# EAGLE design switch (EAGLE 5.10)
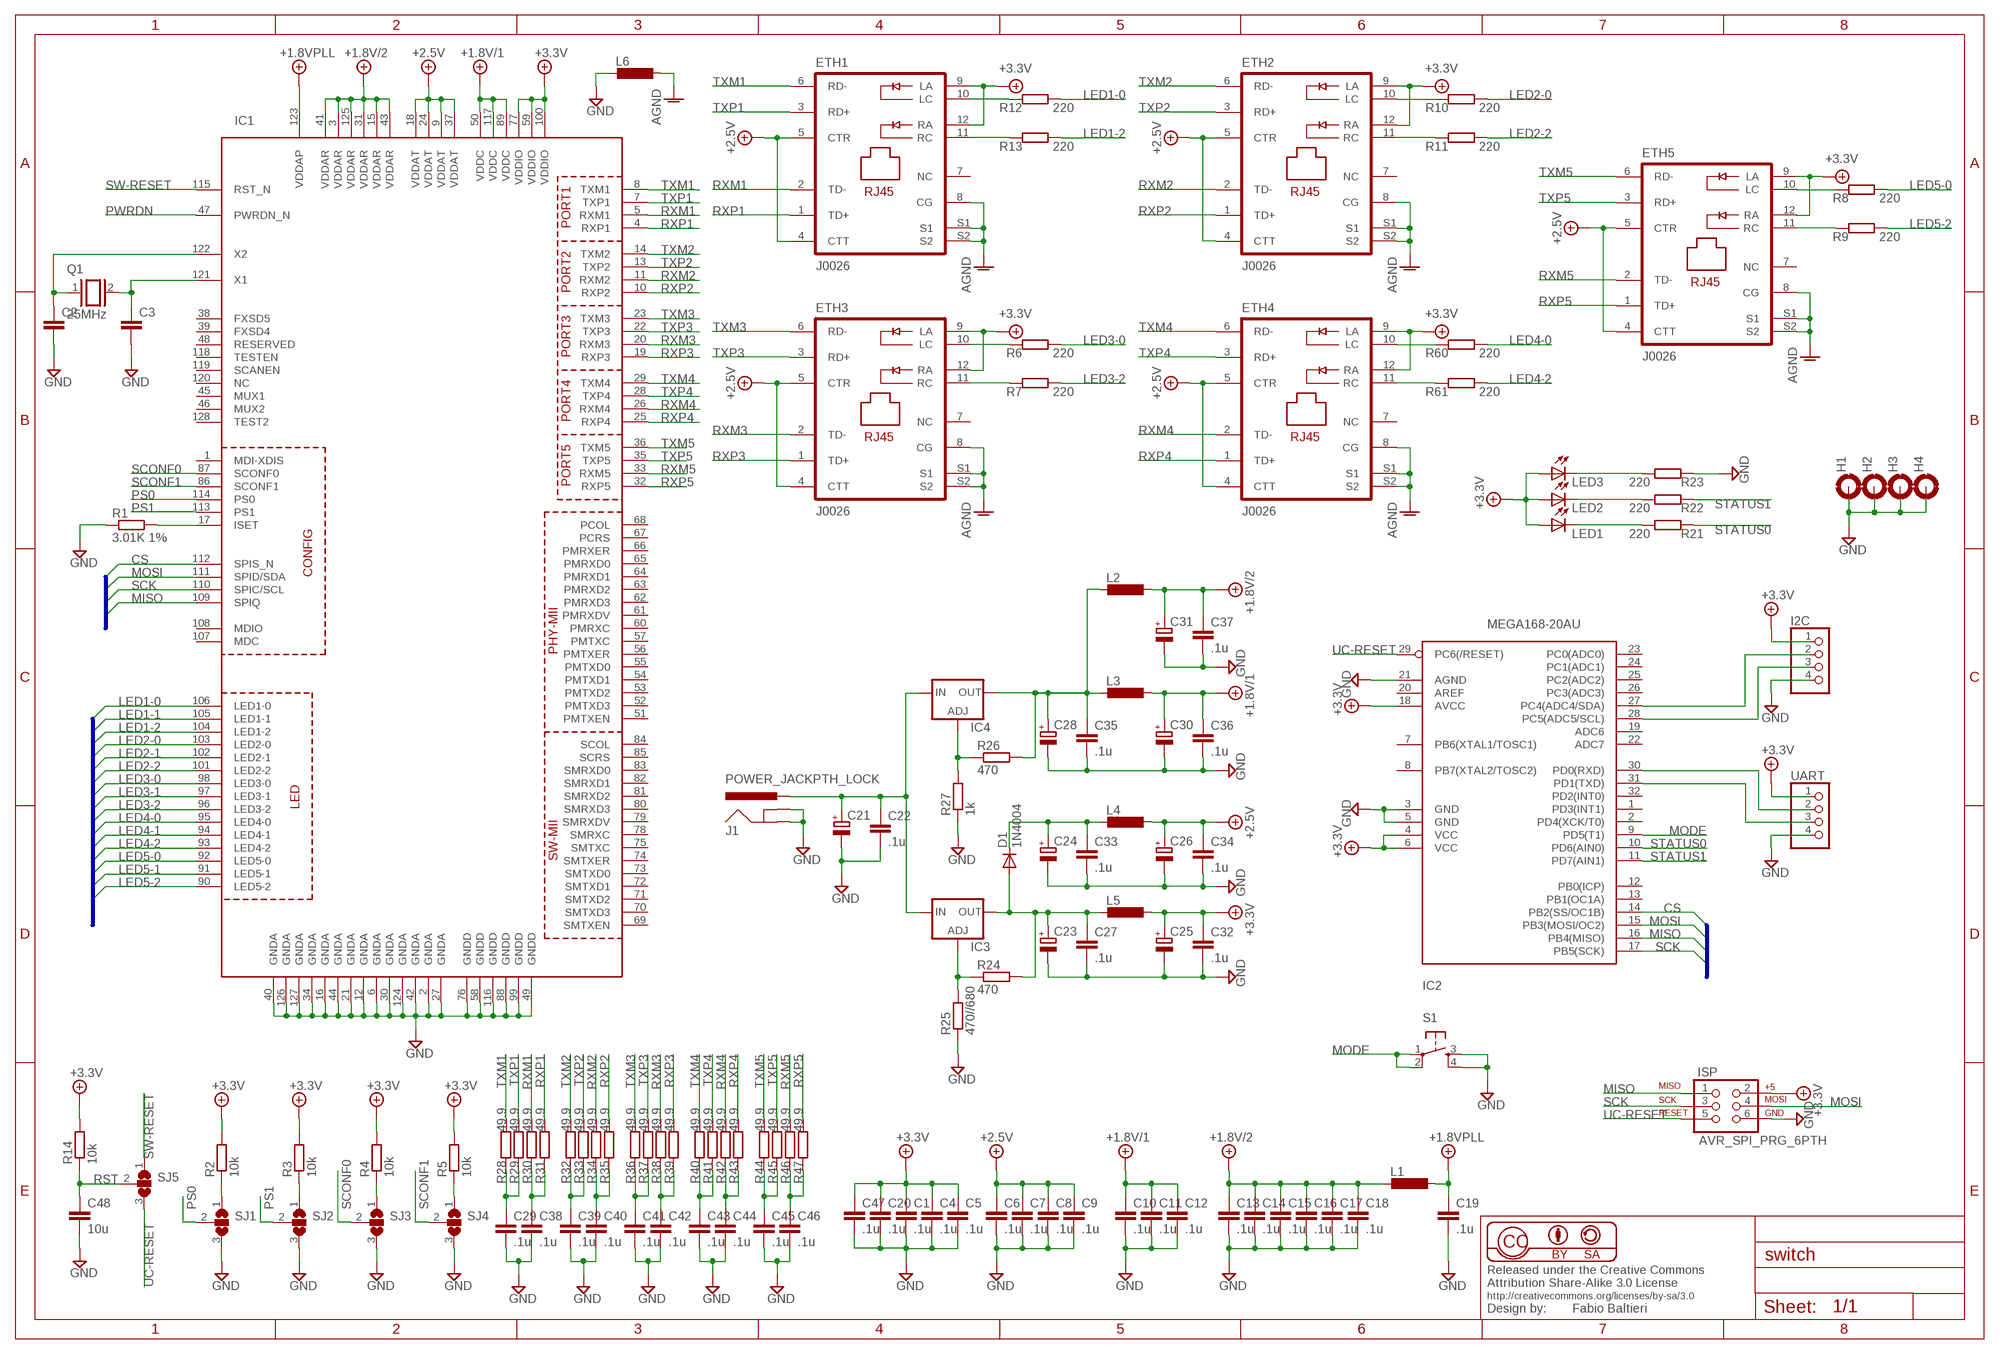
[diagram p0: schematic, sheet 1]

## Parts
C1  .1u  C-EUC0805  [C0805]
C2  C-EUC0805  [C0805]
C3  C-EUC0805  [C0805]
C4  .1u  C-EUC0805  [C0805]
C5  .1u  C-EUC0805  [C0805]
C6  .1u  C-EUC0805  [C0805]
C7  .1u  C-EUC0805  [C0805]
C8  .1u  C-EUC0805  [C0805]
C9  .1u  C-EUC0805  [C0805]
C10  .1u  C-EUC0805  [C0805]
C11  .1u  C-EUC0805  [C0805]
C12  .1u  C-EUC0805  [C0805]
C13  .1u  C-EUC0805  [C0805]
C14  .1u  C-EUC0805  [C0805]
C15  .1u  C-EUC0805  [C0805]
C16  .1u  C-EUC0805  [C0805]
C17  .1u  C-EUC0805  [C0805]
C18  .1u  C-EUC0805  [C0805]
C19  .1u  C-EUC0805  [C0805]
C20  .1u  C-EUC0805  [C0805]
C21  CPOL-EUE2.5-6  [E2,5-6]
C22  .1u  C-EUC0805  [C0805]
C23  CPOL-EUE2.5-6  [E2,5-6]
C24  CPOL-EUE2.5-6  [E2,5-6]
C25  CPOL-EUE2.5-6  [E2,5-6]
C26  CPOL-EUE2.5-6  [E2,5-6]
C27  .1u  C-EUC0805  [C0805]
C28  CPOL-EUE2.5-6  [E2,5-6]
C29  .1u  C-EUC0805  [C0805]
C30  CPOL-EUE2.5-6  [E2,5-6]
C31  CPOL-EUE2.5-6  [E2,5-6]
C32  .1u  C-EUC0805  [C0805]
C33  .1u  C-EUC0805  [C0805]
C34  .1u  C-EUC0805  [C0805]
C35  .1u  C-EUC0805  [C0805]
C36  .1u  C-EUC0805  [C0805]
C37  .1u  C-EUC0805  [C0805]
C38  .1u  C-EUC0805  [C0805]
C39  .1u  C-EUC0805  [C0805]
C40  .1u  C-EUC0805  [C0805]
C41  .1u  C-EUC0805  [C0805]
C42  .1u  C-EUC0805  [C0805]
C43  .1u  C-EUC0805  [C0805]
C44  .1u  C-EUC0805  [C0805]
C45  .1u  C-EUC0805  [C0805]
C46  .1u  C-EUC0805  [C0805]
C47  .1u  C-EUC0805  [C0805]
C48  10u  C-EUC0805  [C0805]
D1  1N4004  [DO41-10]
ETH1  J0026  [PJ-J0]
ETH2  J0026  [PJ-J0]
ETH3  J0026  [PJ-J0]
ETH4  J0026  [PJ-J0]
ETH5  J0026  [PJ-J0]
H1  MOUNT-PAD-ROUND2.8  [2,8-PAD]
H2  MOUNT-PAD-ROUND2.8  [2,8-PAD]
H3  MOUNT-PAD-ROUND2.8  [2,8-PAD]
H4  MOUNT-PAD-ROUND2.8  [2,8-PAD]
I2C  PINHD-1X4  [1X04]
IC1  KS8995MA  [PQFP128L]
IC2  MEGA168-20AU  MEGA8-AI  [TQFP32-08]
IC3  LM317TS  [317TS]
IC4  LM317TS  [317TS]
ISP  AVR_SPI_PRG_6PTH  [2X3]
J1  POWER_JACKPTH_LOCK  [POWER_JACK_PTH_LOCK]
L1  L-EUL3216C  [L3216C]
L2  L-EUL3216C  [L3216C]
L3  L-EUL3216C  [L3216C]
L4  L-EUL3216C  [L3216C]
L5  L-EUL3216C  [L3216C]
L6  L-EUL3216C  [L3216C]
LED1  LED3MM  [LED3MM]
LED2  LED3MM  [LED3MM]
LED3  LED3MM  [LED3MM]
Q1  25MHz  XTAL/S  [QS]
R1  3.01K 1%  R-EU_R0805  [R0805]
R2  10k  R-EU_R0805  [R0805]
R3  10k  R-EU_R0805  [R0805]
R4  10k  R-EU_R0805  [R0805]
R5  10k  R-EU_R0805  [R0805]
R6  220  R-EU_R0805  [R0805]
R7  220  R-EU_R0805  [R0805]
R8  220  R-EU_R0805  [R0805]
R9  220  R-EU_R0805  [R0805]
R10  220  R-EU_R0805  [R0805]
R11  220  R-EU_R0805  [R0805]
R12  220  R-EU_R0805  [R0805]
R13  220  R-EU_R0805  [R0805]
R14  10k  R-EU_R0805  [R0805]
R21  220  R-EU_R0805  [R0805]
R22  220  R-EU_R0805  [R0805]
R23  220  R-EU_R0805  [R0805]
R24  470  R-EU_R0805  [R0805]
R25  470//680  R-EU_R0805  [R0805]
R26  470  R-EU_R0805  [R0805]
R27  1k  R-EU_R0805  [R0805]
R28  49.9  R-EU_R0805  [R0805]
R29  49.9  R-EU_R0805  [R0805]
R30  49.9  R-EU_R0805  [R0805]
R31  49.9  R-EU_R0805  [R0805]
R32  49.9  R-EU_R0805  [R0805]
R33  49.9  R-EU_R0805  [R0805]
R34  49.9  R-EU_R0805  [R0805]
R35  49.9  R-EU_R0805  [R0805]
R36  49.9  R-EU_R0805  [R0805]
R37  49.9  R-EU_R0805  [R0805]
R38  49.9  R-EU_R0805  [R0805]
R39  49.9  R-EU_R0805  [R0805]
R40  49.9  R-EU_R0805  [R0805]
R41  49.9  R-EU_R0805  [R0805]
R42  49.9  R-EU_R0805  [R0805]
R43  49.9  R-EU_R0805  [R0805]
R44  49.9  R-EU_R0805  [R0805]
R45  49.9  R-EU_R0805  [R0805]
R46  49.9  R-EU_R0805  [R0805]
R47  49.9  R-EU_R0805  [R0805]
R60  220  R-EU_R0805  [R0805]
R61  220  R-EU_R0805  [R0805]
S1  TAC_SWITCHSMD  [TACTILE_SWITCH_SMD]
SJ1  SJ2W  [SJ_2]
SJ2  SJ2W  [SJ_2]
SJ3  SJ2W  [SJ_2]
SJ4  SJ2W  [SJ_2]
SJ5  SJ2W  [SJ_2]
UART  PINHD-1X4  [1X04]

## Nets
+5V [Power]: C1.1 C4.1 C5.1 C20.1 C25.+ C32.1 C47.1 ETH1.9(LA) ETH1.12(RA) ETH2.9(LA) ETH2.12(RA) ETH3.9(LA) ETH3.12(RA) ETH4.9(LA) ETH4.12(RA) ETH5.9(LA) ETH5.12(RA) I2C.1 IC1.59(VDDIO) IC1.77(VDDIO) IC1.100(VDDIO) IC2.4(VCC) IC2.6(VCC) IC2.18(AVCC) ISP.2 L5.1 LED1.A LED2.A LED3.A R2.2 R3.2 R4.2 R5.2 R14.2 UART.1 ; supply symbol labelled +3.3V
+5V/1 [Power]: C6.1 C7.1 C8.1 C9.1 C26.+ C34.1 ETH1.4(CTT) ETH1.5(CTR) ETH2.4(CTT) ETH2.5(CTR) ETH3.4(CTT) ETH3.5(CTR) ETH4.4(CTT) ETH4.5(CTR) ETH5.4(CTT) ETH5.5(CTR) IC1.9(VDDAT) IC1.18(VDDAT) IC1.24(VDDAT) IC1.37(VDDAT) L4.1 ; supply symbol labelled +2.5V
+5V/2 [Power]: C10.1 C11.1 C12.1 C30.+ C36.1 IC1.50(VDDC) IC1.89(VDDC) IC1.117(VDDC) L3.1 ; supply symbol labelled +1.8V/1
+5V/3 [Power]: C13.1 C14.1 C15.1 C16.1 C17.1 C18.1 C31.+ C37.1 IC1.3(VDDAR) IC1.15(VDDAR) IC1.31(VDDAR) IC1.41(VDDAR) IC1.43(VDDAR) IC1.125(VDDAR) L1.2 L2.1 ; supply symbol labelled +1.8V/2
+5V/4: C19.1 IC1.123(VDDAP) L1.1 ; supply symbol labelled +1.8VPLL
AGND: ETH1.8(CG) ETH1.S1 ETH1.S2 ETH2.8(CG) ETH2.S1 ETH2.S2 ETH3.8(CG) ETH3.S1 ETH3.S2 ETH4.8(CG) ETH4.S1 ETH4.S2 ETH5.8(CG) ETH5.S1 ETH5.S2 L6.1
CS: IC1.112(SPIS_N) IC2.14(PB2(SS/OC1B))
GND [Power]: C1.2 C2.2 C3.2 C4.2 C5.2 C6.2 C7.2 C8.2 C9.2 C10.2 C11.2 C12.2 C13.2 C14.2 C15.2 C16.2 C17.2 C18.2 C19.2 C20.2 C21.- C22.2 C23.- C24.- C25.- C26.- C27.2 C28.- C29.2 C30.- C31.- C32.2 C33.2 C34.2 C35.2 C36.2 C37.2 C38.2 C39.2 C40.2 C41.2 C42.2 C43.2 C44.2 C45.2 C46.2 C47.2 C48.2 H1.B2,8(MOUNT) H2.B2,8(MOUNT) H3.B2,8(MOUNT) H4.B2,8(MOUNT) I2C.4 IC1.2(GNDA) IC1.6(GNDA) IC1.12(GNDA) IC1.16(GNDA) IC1.21(GNDA) IC1.27(GNDA) IC1.30(GNDA) IC1.34(GNDA) IC1.40(GNDA) IC1.42(GNDA) IC1.44(GNDA) IC1.49(GNDD) IC1.58(GNDD) IC1.76(GNDD) IC1.88(GNDD) IC1.99(GNDD) IC1.116(GNDD) IC1.124(GNDA) IC1.126(GNDA) IC1.127(GNDA) IC2.3(GND) IC2.5(GND) IC2.21(AGND) ISP.6 J1.GND J1.GNDBREAK L6.2 R1.1 R23.1 R25.1 R27.1 S1.3 S1.4 SJ1.3 SJ2.3 SJ3.3 SJ4.3 UART.4
LED1-0: IC1.106(LED1-0) R12.1
LED1-1: IC1.105(LED1-1)
LED1-2: IC1.104(LED1-2) R13.1
LED2-0: IC1.103(LED2-0) R10.1
LED2-1: IC1.102(LED2-1)
LED2-2: IC1.101(LED2-2) R11.1
LED3-0: IC1.98(LED3-0) R6.1
LED3-1: IC1.97(LED3-1)
LED3-2: IC1.96(LED3-2) R7.1
LED4-0: IC1.95(LED4-0) R60.1
LED4-1: IC1.94(LED4-1)
LED4-2: IC1.93(LED4-2) R61.1
LED5-0: IC1.92(LED5-0) R8.1
LED5-1: IC1.91(LED5-1)
LED5-2: IC1.90(LED5-2) R9.1
MISO: IC1.109(SPIQ) IC2.16(PB4(MISO)) ISP.1
MODE: IC2.9(PD5(T1)) S1.1 S1.2
MOSI: IC1.111(SPID/SDA) IC2.15(PB3(MOSI/OC2)) ISP.4
N$1: IC1.17(ISET) R1.2
N$2: C2.1 IC1.122(X2) Q1.1
N$3: R2.1 SJ1.1
N$4: C3.1 IC1.121(X1) Q1.2
N$5: ETH1.11(RC) R13.2
N$6: R3.1 SJ2.1
N$7: R5.1 SJ4.1
N$8: R4.1 SJ3.1
N$9: ETH3.10(LC) R6.2
N$10: ETH3.11(RC) R7.2
N$11: ETH5.10(LC) R8.2
N$12: ETH5.11(RC) R9.2
N$13: ETH2.10(LC) R10.2
N$14: ETH1.10(LC) R12.2
N$15: ETH2.11(RC) R11.2
N$23: LED1.K(C) R21.2
N$24: LED2.K(C) R22.2
N$25: LED3.K(C) R23.2
N$26: I2C.2 IC2.27(PC4(ADC4/SDA))
N$27 [Power]: C21.+ C22.1 IC3.3(IN) IC4.3(IN) J1.PWR
N$28 [Power]: C28.+ C35.1 IC4.2(OUT) L2.2 L3.2 R26.2
N$29: I2C.3 IC2.28(PC5(ADC5/SCL))
N$30: IC2.30(PD0(RXD)) UART.2
N$31: IC2.31(PD1(TXD)) UART.3
N$47: IC3.1(ADJ) R24.1 R25.2
N$48: IC4.1(ADJ) R26.1 R27.2
N$49 [Power]: C23.+ C27.1 D1.A IC3.2(OUT) L5.2 R24.2
N$50 [Power]: C24.+ C33.1 D1.C L4.2
N$51: C29.1 R28.1 R29.1
N$53: C38.1 R30.1 R31.1
N$54: C39.1 R32.1 R33.1
N$55: C40.1 R34.1 R35.1
N$56: C41.1 R36.1 R37.1
N$57: C42.1 R38.1 R39.1
N$58: C43.1 R40.1 R41.1
N$59: C44.1 R42.1 R43.1
N$60: C45.1 R44.1 R45.1
N$61: C46.1 R46.1 R47.1
N$68: ETH4.10(LC) R60.2
N$69: ETH4.11(RC) R61.2
PS0: IC1.114(PS0) SJ1.2
PS1: IC1.113(PS1) SJ2.2
PWRDN: IC1.47(PWRDN_N)
RST: C48.1 R14.1 SJ5.2
RXM1: ETH1.2(TD-) IC1.5(RXM1) R30.2
RXM2: ETH2.2(TD-) IC1.11(RXM2) R34.2
RXM3: ETH3.2(TD-) IC1.20(RXM3) R38.2
RXM4: ETH4.2(TD-) IC1.26(RXM4) R42.2
RXM5: ETH5.2(TD-) IC1.33(RXM5) R46.2
RXP1: ETH1.1(TD+) IC1.4(RXP1) R31.2
RXP2: ETH2.1(TD+) IC1.10(RXP2) R35.2
RXP3: ETH3.1(TD+) IC1.19(RXP3) R39.2
RXP4: ETH4.1(TD+) IC1.25(RXP4) R43.2
RXP5: ETH5.1(TD+) IC1.32(RXP5) R47.2
SCK: IC1.110(SPIC/SCL) IC2.17(PB5(SCK)) ISP.3
SCONF0: IC1.87(SCONF0) SJ3.2
SCONF1: IC1.86(SCONF1) SJ4.2
STATUS0: IC2.10(PD6(AIN0)) R21.1
STATUS1: IC2.11(PD7(AIN1)) R22.1
SW-RESET: IC1.115(RST_N) SJ5.1
TXM1: ETH1.6(RD-) IC1.8(TXM1) R28.2
TXM2: ETH2.6(RD-) IC1.14(TXM2) R32.2
TXM3: ETH3.6(RD-) IC1.23(TXM3) R36.2
TXM4: ETH4.6(RD-) IC1.29(TXM4) R40.2
TXM5: ETH5.6(RD-) IC1.36(TXM5) R44.2
TXP1: ETH1.3(RD+) IC1.7(TXP1) R29.2
TXP2: ETH2.3(RD+) IC1.13(TXP2) R33.2
TXP3: ETH3.3(RD+) IC1.22(TXP3) R37.2
TXP4: ETH4.3(RD+) IC1.28(TXP4) R41.2
TXP5: ETH5.3(RD+) IC1.35(TXP5) R45.2
UC-RESET: IC2.29(PC6(/RESET)) ISP.5 SJ5.3
Unconnected: ETH1.7(NC) ETH2.7(NC) ETH3.7(NC) ETH4.7(NC) ETH5.7(NC) IC1.1(MDI-XDIS) IC1.38(FXSD5) IC1.39(FXSD4) IC1.45(MUX1) IC1.46(MUX2) IC1.48(RESERVED) IC1.51(PMTXEN) IC1.52(PMTXD3) IC1.53(PMTXD2) IC1.54(PMTXD1) IC1.55(PMTXD0) IC1.56(PMTXER) IC1.57(PMTXC) IC1.60(PMRXC) IC1.61(PMRXDV) IC1.62(PMRXD3) IC1.63(PMRXD2) IC1.64(PMRXD1) IC1.65(PMRXD0) IC1.66(PMRXER) IC1.67(PCRS) IC1.68(PCOL) IC1.69(SMTXEN) IC1.70(SMTXD3) IC1.71(SMTXD2) IC1.72(SMTXD1) IC1.73(SMTXD0) IC1.74(SMTXER) IC1.75(SMTXC) IC1.78(SMRXC) IC1.79(SMRXDV) IC1.80(SMRXD3) IC1.81(SMRXD2) IC1.82(SMRXD1) IC1.83(SMRXD0) IC1.84(SCOL) IC1.85(SCRS) IC1.107(MDC) IC1.108(MDIO) IC1.118(TESTEN) IC1.119(SCANEN) IC1.120(NC) IC1.128(TEST2) IC2.1(PD3(INT1)) IC2.2(PD4(XCK/T0)) IC2.7(PB6(XTAL1/TOSC1)) IC2.8(PB7(XTAL2/TOSC2)) IC2.12(PB0(ICP)) IC2.13(PB1(OC1A)) IC2.19(ADC6) IC2.20(AREF) IC2.22(ADC7) IC2.23(PC0(ADC0)) IC2.24(PC1(ADC1)) IC2.25(PC2(ADC2)) IC2.26(PC3(ADC3)) IC2.32(PD2(INT0))

## Buses
LED1-[0..2],LED2-[0..2],LED3-[0..2],LED4-[0..2],LED5-[0..2]
SCK,MISO,MOSI,CS

## Library data of the parts
C1-C20 C22 C27 C29 C32-C48 = rcl:C-EU: CAPACITOR, European symbol
C21 C23-C26 C28 C30 C31 = rcl:CPOL-EU: POLARIZED CAPACITOR, European symbol
D1 = diode:1N4004: DIODE general purpose rectifier, 1 A
ETH1-ETH5 = micrel:J0026: RJ45 PulseJack w/LEDs
H1-H4 = holes:MOUNT-PAD-ROUND: MOUNTING PAD, round
I2C UART = pinhead:PINHD-1X4: PIN HEADER
IC1 = micrel:KS8995MA: 5 Port Managed Ethernet Switch
IC2 = atmel:MEGA8: MICROCONTROLLER 8 Kbytes FLASH, 1 kbytes SRAM, 512 bytes EEPROM, USART, 6-channel 10 bit ADC, 2-channel 8 bit ADC Pin compatible with Atmega48, ATMega88, ATMega168 Source: avr.lbr
IC3 IC4 = v-reg:LM317TS: VOLTAGE REGULATOR
ISP = SparkFun:AVR_SPI_PRG_6: AVR ISP 6 Pin This is the reduced ISP connector for AVR programming. Common on Arduino. This footprint will take up less PCB space and can be used with a 10-pin to 6-pin adapter such as SKU: BOB-08508
J1 = SparkFun:POWER_JACK: Power Jack This is the standard 5.5mm barrel jack for power. The PTH is the most common, proven, reliable, footprint. All others are experimental. The Slot footprint only works if the mill layer is transmitted to the PCB fab house so be warned. Spark Fun Electronics SKU : PRT-00119. Mating wall wart : TOL-00298 (and others)
L1-L6 = rcl:L-EU: INDUCTOR, European symbol
LED1-LED3 = led:LED: LED OSRAM: - CHIPLED LG R971, LG N971, LY N971, LG Q971, LY Q971, LO R971, LY R971 LH N974, LH R974 LS Q976, LO Q976, LY Q976 LO Q996 - Hyper CHIPLED LW Q18S LB Q993, LB Q99A, LB R99A - SideLED LS A670, LO A670, LY A670, LG A670, LP A670 LB A673, LV A673, LT A673, LW A673 LH A674 LY A675 LS A676, LA A676, LO A676, LY A676, LW A676 LS A679, LY A679, LG A679 - Hyper Micro SIDELED® LS Y876, LA Y876, LO Y876, LY Y876 LT Y87S - SmartLED LW L88C, LW L88S LB L89C, LB L89S, LG L890 LS L89K, LO L89K, LY L89K LS L896, LA L896, LO L896, LY L896 - TOPLED LS T670, LO T670, LY T670, LG T670, LP T670 LSG T670, LSP T670, LSY T670, LOP T670, LYG T670 LG T671, LOG T671, LSG T671 LB T673, LV T673, LT T673, LW T673 LH T674 LS T676, LA T676, LO T676, LY T676, LB T676, LH T676, LSB T676, LW T676 LB T67C, LV T67C, LT T67C, LS T67K, LO T67K, LY T67K, LW E67C LS E67B, LA E67B, LO E67B, LY E67B, LB E67C, LV E67C, LT E67C LW T67C LS T679, LY T679, LG T679 LS T770, LO T770, LY T770, LG T770, LP T770 LB T773, LV T773, LT T773, LW T773 LH T774 LS E675, LA E675, LY E675, LS T675 LS T776, LA T776, LO T776, LY T776, LB T776 LHGB T686 LT T68C, LB T68C - Hyper Mini TOPLED® LB M676 - Mini TOPLED Santana® LG M470 LS M47K, LO M47K, LY M47K Source: http://www.osram.convergy.de LUXEON: - LUMILED® LXK2-PW12-R00, LXK2-PW12-S00, LXK2-PW14-U00, LXK2-PW14-V00 LXK2-PM12-R00, LXK2-PM12-S00, LXK2-PM14-U00 LXK2-PE12-Q00, LXK2-PE12-R00, LXK2-PE12-S00, LXK2-PE14-T00, LXK2-PE14-U00 LXK2-PB12-K00, LXK2-PB12-L00, LXK2-PB12-M00, LXK2-PB14-N00, LXK2-PB14-P00, LXK2-PB14-Q00 LXK2-PR12-L00, LXK2-PR12-M00, LXK2-PR14-Q00, LXK2-PR14-R00 LXK2-PD12-Q00, LXK2-PD12-R00, LXK2-PD12-S00 LXK2-PH12-R00, LXK2-PH12-S00 LXK2-PL12-P00, LXK2-PL12-Q00, LXK2-PL12-R00 Source: www.luxeon.com KINGBRIGHT: KA-3528ASYC Source: www.kingbright.com
Q1 = special:XTAL/S: CRYSTAL
R1-R14 R21-R47 R60 R61 = rcl:R-EU_: RESISTOR, European symbol
S1 = SparkFun:TAC_SWITCH: Momentary Switch Button commonly used for reset or general input. Spark Fun Electronics SKU : COM-00097
SJ1-SJ5 = jumper:SJ2W: SMD solder JUMPER

## Net classes
1 Power: width 0.61 mm

## Board
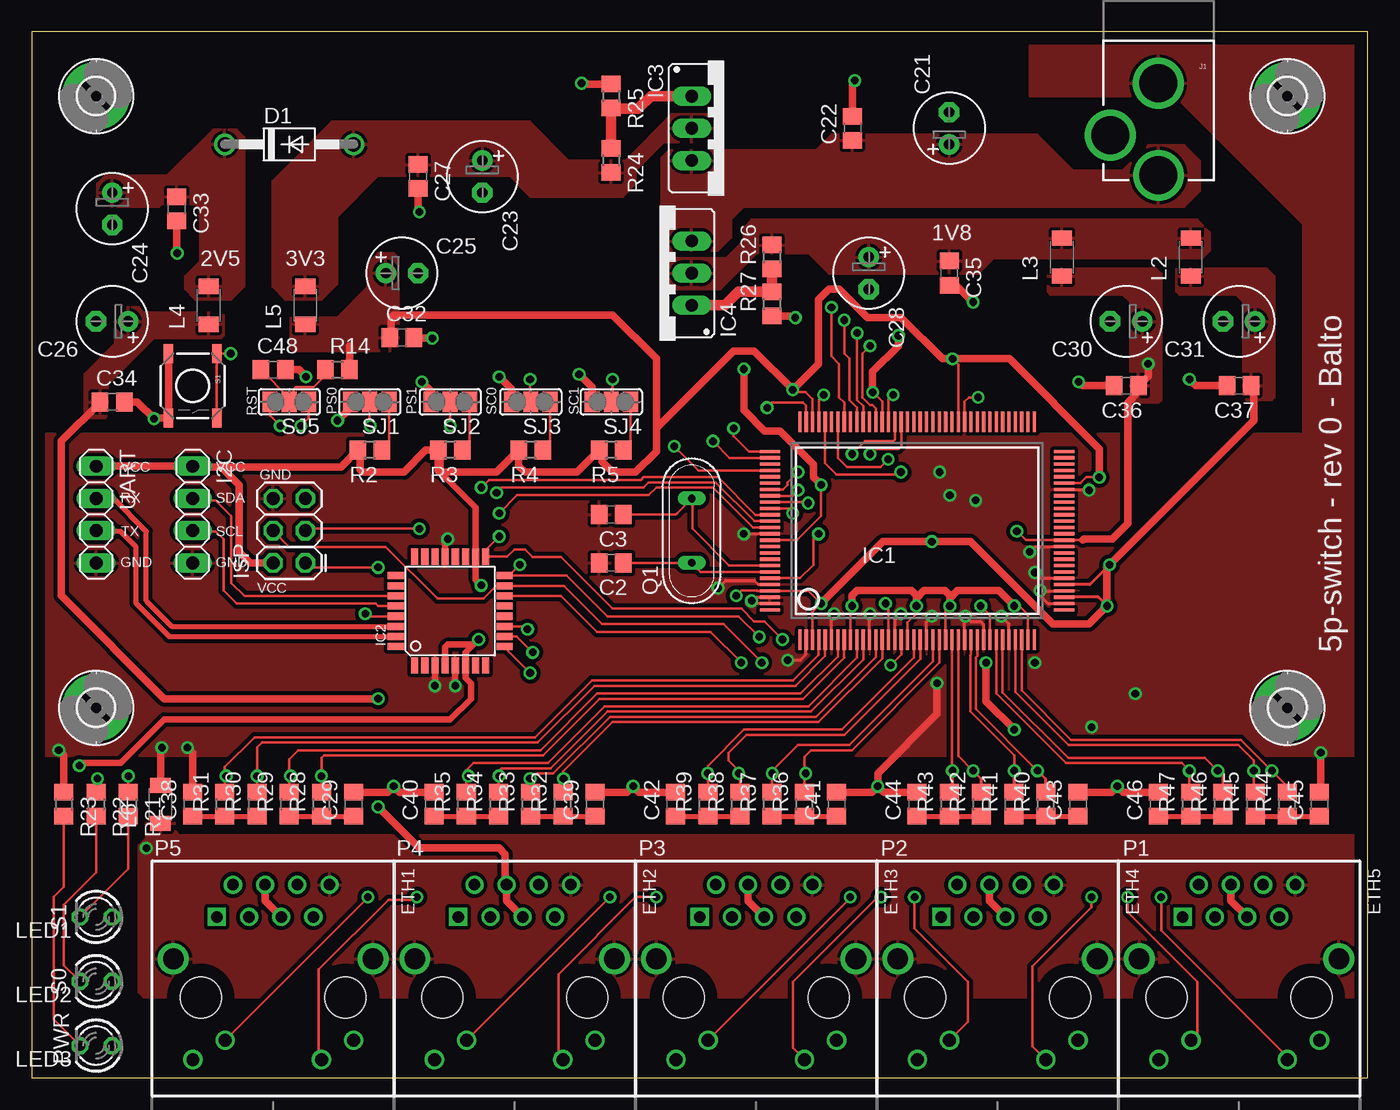
[diagram p1: board, top side]
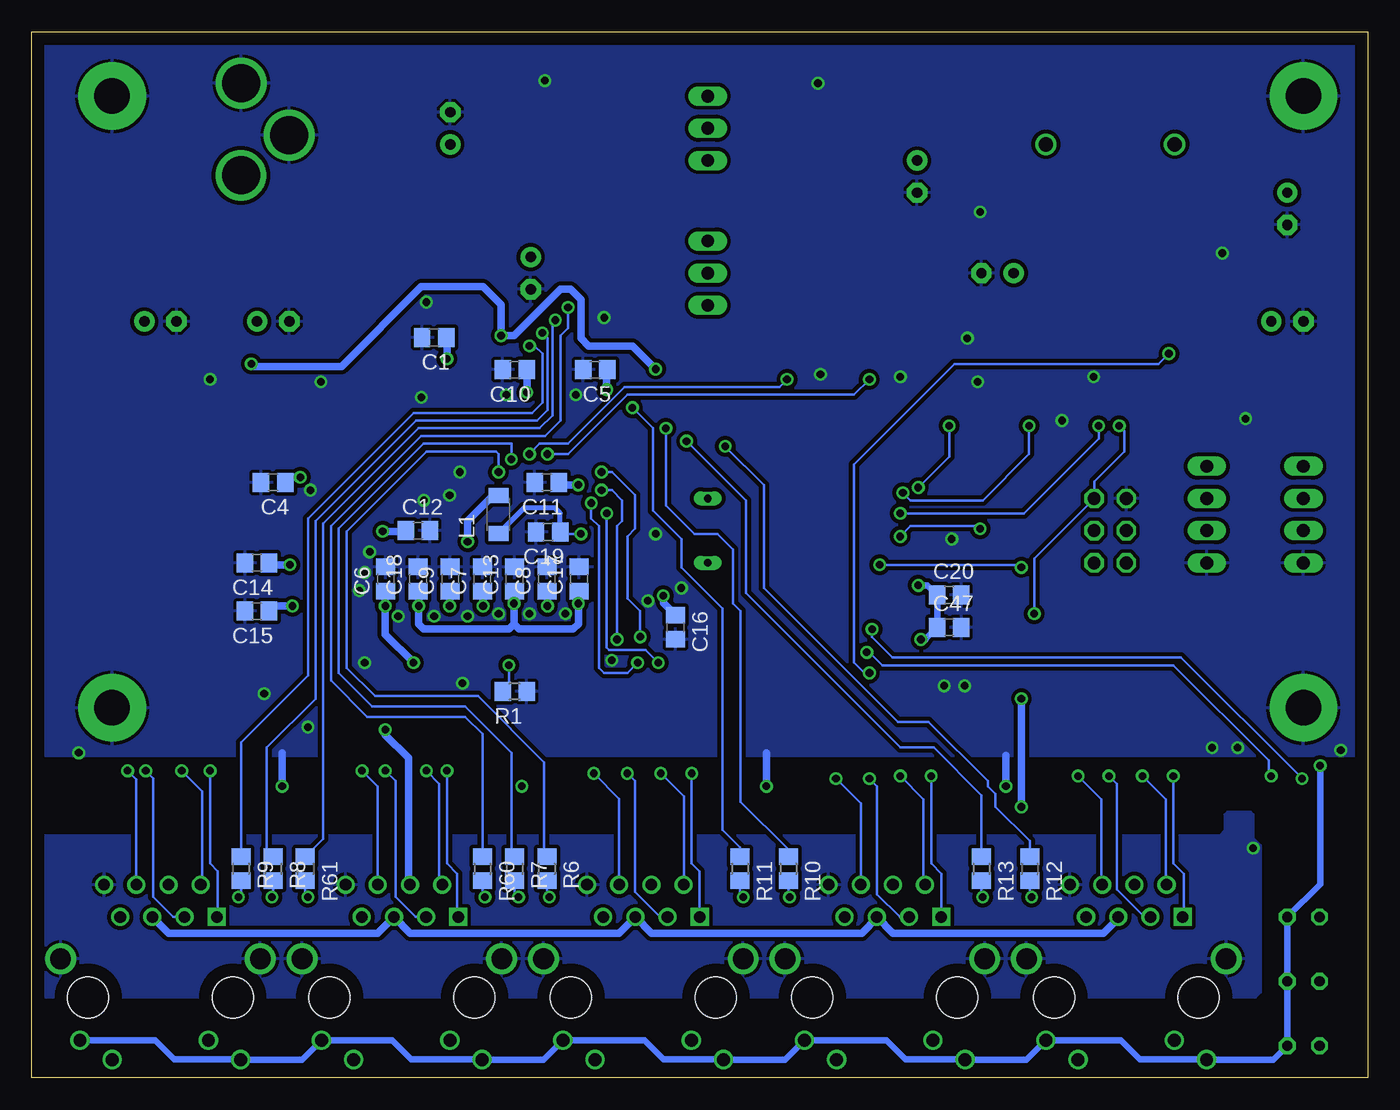
[diagram p2: board, bottom side, seen from below]

Size 105.41 x 82.55 mm. Coordinates in mm from the lower left corner, seen from the top.
Outline: 105.41,82.55 0,82.55 0,0 105.41,0.01 105.41,82.55
Copper layers (1*16): Top 0.035mm / dielectric 1.5mm / Bottom 0.035mm
Design rules "default *": minimum track width 8mil, minimum drill 20mil, track to track 8mil, track to pad 8mil, pad to pad 8mil, via to via 8mil, smd to smd 8mil, copper to edge 40mil, drill to drill 8mil, minimum pad ring 10mil, minimum via ring 8mil, stop-mask expansion 4mil, vias tented up to drill 24mil, thermal gap 10mil

### Footprints (pad centres in the part's own frame; a part is rotated, then mirrored left to right if it is on the bottom)
C0805 = smd 1.3 x 1.5: 1 -0.95,0; 2 0.95,0
E2,5-6 = drill 0.813 pad 1.6 round: + -1.27,0 | drill 0.813 pad 1.6 octagon: - 1.27,0
DO41-10 = drill 1.118 round: A 5.08,0; C -5.08,0
PJ-J0 = drill 0.914 square: 1 4.445,-6.35 | drill 0.914 round: 2 3.175,-8.89; 3 1.905,-6.35; 4 0.635,-8.89; 5 -0.635,-6.35; 6 -1.905,-8.89; 7 -3.175,-6.35; 8 -4.445,-8.89 | drill 1.016 round: 9 6.325,4.902; 10 3.785,3.378; 11 -3.81,4.902; 12 -6.35,3.378 | drill 1.626 round: S1 -7.874,-3.048; S2 7.874,-3.048 | hole 3.251: -5.715,0; 5.715,0
2,8-PAD = drill 2.8 pad 5.334 round: B2,8 0,0
1X04 = drill 1.016 long: 1 -3.81,0; 2 -1.27,0; 3 1.27,0; 4 3.81,0
PQFP128L = smd 0.25 x 1.6: 1 -9.25,-8.6; 2 -8.75,-8.6; 3 -8.25,-8.6; 4 -7.75,-8.6; 5 -7.25,-8.6; 6 -6.75,-8.6; 7 -6.25,-8.6; 8 -5.75,-8.6; 9 -5.25,-8.6; 10 -4.75,-8.6; 11 -4.25,-8.6; 12 -3.75,-8.6; 13 -3.25,-8.6; 14 -2.75,-8.6; 15 -2.25,-8.6; 16 -1.75,-8.6; 17 -1.25,-8.6; 18 -0.75,-8.6; 19 -0.25,-8.6; 20 0.25,-8.6; 21 0.75,-8.6; 22 1.25,-8.6; 23 1.75,-8.6; 24 2.25,-8.6; 25 2.75,-8.6; 26 3.25,-8.6; 27 3.75,-8.6; 28 4.25,-8.6; 29 4.75,-8.6; 30 5.25,-8.6; 31 5.75,-8.6; 32 6.25,-8.6; 33 6.75,-8.6; 34 7.25,-8.6; 35 7.75,-8.6; 36 8.25,-8.6; 37 8.75,-8.6; 38 9.25,-8.6; 65 9.25,8.6; 66 8.75,8.6; 67 8.25,8.6; 68 7.75,8.6; 69 7.25,8.6; 70 6.75,8.6; 71 6.25,8.6; 72 5.75,8.6; 73 5.25,8.6; 74 4.75,8.6; 75 4.25,8.6; 76 3.75,8.6; 77 3.25,8.6; 78 2.75,8.6; 79 2.25,8.6; 80 1.75,8.6; 81 1.25,8.6; 82 0.75,8.6; 83 0.25,8.6; 84 -0.25,8.6; 85 -0.75,8.6; 86 -1.25,8.6; 87 -1.75,8.6; 88 -2.25,8.6; 89 -2.75,8.6; 90 -3.25,8.6; 91 -3.75,8.6; 92 -4.25,8.6; 93 -4.75,8.6; 94 -5.25,8.6; 95 -5.75,8.6; 96 -6.25,8.6; 97 -6.75,8.6; 98 -7.25,8.6; 99 -7.75,8.6; 100 -8.25,8.6; 101 -8.75,8.6; 102 -9.25,8.6 | smd 1.6 x 0.25: 39 11.6,-6.25; 40 11.6,-5.75; 41 11.6,-5.25; 42 11.6,-4.75; 43 11.6,-4.25; 44 11.6,-3.75; 45 11.6,-3.25; 46 11.6,-2.75; 47 11.6,-2.25; 48 11.6,-1.75; 49 11.6,-1.25; 50 11.6,-0.75; 51 11.6,-0.25; 52 11.6,0.25; 53 11.6,0.75; 54 11.6,1.25; 55 11.6,1.75; 56 11.6,2.25; 57 11.6,2.75; 58 11.6,3.25; 59 11.6,3.75; 60 11.6,4.25; 61 11.6,4.75; 62 11.6,5.25; 63 11.6,5.75; 64 11.6,6.25; 103 -11.6,6.25; 104 -11.6,5.75; 105 -11.6,5.25; 106 -11.6,4.75; 107 -11.6,4.25; 108 -11.6,3.75; 109 -11.6,3.25; 110 -11.6,2.75; 111 -11.6,2.25; 112 -11.6,1.75; 113 -11.6,1.25; 114 -11.6,0.75; 115 -11.6,0.25; 116 -11.6,-0.25; 117 -11.6,-0.75; 118 -11.6,-1.25; 119 -11.6,-1.75; 120 -11.6,-2.25; 121 -11.6,-2.75; 122 -11.6,-3.25; 123 -11.6,-3.75; 124 -11.6,-4.25; 125 -11.6,-4.75; 126 -11.6,-5.25; 127 -11.6,-5.75; 128 -11.6,-6.25
TQFP32-08 = smd 1.27 x 0.559: 1 -4.293,2.8; 2 -4.293,2; 3 -4.293,1.2; 4 -4.293,0.4; 5 -4.293,-0.4; 6 -4.293,-1.2; 7 -4.293,-2; 8 -4.293,-2.8; 17 4.293,-2.8; 18 4.293,-2; 19 4.293,-1.2; 20 4.293,-0.4; 21 4.293,0.4; 22 4.293,1.2; 23 4.293,2; 24 4.293,2.8 | smd 0.559 x 1.27: 9 -2.8,-4.293; 10 -2,-4.293; 11 -1.2,-4.293; 12 -0.4,-4.293; 13 0.4,-4.293; 14 1.2,-4.293; 15 2,-4.293; 16 2.8,-4.293; 25 2.8,4.293; 26 2,4.293; 27 1.2,4.293; 28 0.4,4.293; 29 -0.4,4.293; 30 -1.2,4.293; 31 -2,4.293; 32 -2.8,4.293
317TS = drill 1.016 long: 1 -2.54,-2.54; 2 0,-2.54; 3 2.54,-2.54
2X3 = drill 1.016 octagon: 1 0,0; 2 0,2.54; 3 2.54,0; 4 2.54,2.54; 5 5.08,0; 6 5.08,2.54
POWER_JACK_PTH_LOCK = drill 2.997 round: GND 0.025,6.608; GNDBREAK 3.812,10.7; PWR 0,13.878
L3216C = smd 1.2 x 1.6: 1 -1.5,0; 2 1.5,0
LED3MM = drill 0.813 octagon: A -1.27,0; K 1.27,0
QS = drill 0.61 long: 1 -2.54,0; 2 2.54,0
R0805 = smd 1.3 x 1.5: 1 -0.95,0; 2 0.95,0
TACTILE_SWITCH_SMD = smd 1.524 x 0.762: 1 -2.54,1.905; 2 2.54,1.905; 3 -2.54,-1.905; 4 2.54,-1.905
SJ_2 = smd 1.168 x 1.6: 1 -1.524,0; 2 0,0; 3 1.524,0

### Placement (x,y rotation side)
C1  73.66,58.42 180 bottom
C2  45.72,40.64 180 top
C3  45.72,44.45 180 top
C4  86.36,46.99 180 bottom
C5  60.96,55.88 180 bottom
C6  77.47,39.37 90 bottom
C7  69.85,39.37 90 bottom
C8  64.77,39.37 90 bottom
C9  72.39,39.37 90 bottom
C10  67.31,55.88 180 bottom
C11  64.77,46.99 180 bottom
C12  74.93,43.18 0 bottom
C13  67.31,39.37 90 bottom
C14  87.63,40.64 180 bottom
C15  87.63,36.83 180 bottom
C16  54.61,35.56 270 bottom
C17  62.23,39.37 90 bottom
C18  74.93,39.37 90 bottom
C19  64.67,43.08 180 bottom
C20  33.02,38.1 0 bottom
C21  72.39,74.93 90 top
C22  64.77,74.93 90 top
C23  35.56,71.12 270 top
C24  6.35,68.58 270 top
C25  29.21,63.5 0 top
C26  6.35,59.69 180 top
C27  30.48,71.12 270 top
C28  66.04,63.5 270 top
C29  25.4,21.59 90 top
C30  86.36,59.69 180 top
C31  95.25,59.69 180 top
C32  29.21,58.42 0 top
C33  11.43,68.58 270 top
C34  6.35,53.34 0 top
C35  72.39,63.5 270 top
C36  86.36,54.61 180 top
C37  95.25,54.61 180 top
C38  12.7,21.59 90 top
C39  44.45,21.59 90 top
C40  31.75,21.59 90 top
C41  63.5,21.59 90 top
C42  50.8,21.59 90 top
C43  82.55,21.59 90 top
C44  69.85,21.59 90 top
C45  101.6,21.59 90 top
C46  88.9,21.59 90 top
C47  33.02,35.56 0 bottom
C48  19.05,55.88 0 top
D1  20.32,73.66 0 top
ETH1  19.05,6.35 180 top
ETH2  38.1,6.35 180 top
ETH3  57.15,6.35 180 top
ETH4  76.2,6.35 180 top
ETH5  95.25,6.35 180 top
H1  5.08,29.21 0 top
H2  99.06,29.21 0 top
H3  99.06,77.47 0 top
H4  5.08,77.47 0 top
I2C  12.7,44.45 270 top
IC1  69.85,43.18 0 top
IC2  33.02,36.83 90 top
IC3  54.61,74.93 270 top
IC4  49.53,63.5 90 top
ISP  21.59,40.64 90 top
J1  88.9,85.09 180 top
L1  68.58,44.45 90 bottom
L2  91.44,64.77 90 top
L3  81.28,64.77 90 top
L4  13.97,60.96 90 top
L5  21.59,60.96 90 top
L6  10.16,21.59 90 top
LED1  5.08,12.7 180 top
LED2  5.08,7.62 180 top
LED3  5.08,2.54 180 top
Q1  52.07,43.18 90 top
R1  67.31,30.48 180 bottom
R2  26.67,49.53 180 top
R3  33.02,49.53 180 top
R4  39.37,49.53 180 top
R5  45.72,49.53 180 top
R6  64.77,16.51 270 bottom
R7  67.31,16.51 270 bottom
R8  86.36,16.51 270 bottom
R9  88.9,16.51 270 bottom
R10  45.72,16.51 270 bottom
R11  49.53,16.51 270 bottom
R12  26.67,16.51 270 bottom
R13  30.48,16.51 270 bottom
R14  24.13,55.88 0 top
R21  7.62,21.59 270 top
R22  5.08,21.59 270 top
R23  2.54,21.59 270 top
R24  45.72,72.39 270 top
R25  45.72,77.47 270 top
R26  58.42,64.77 90 top
R27  58.42,61.06 90 top
R28  22.86,21.59 90 top
R29  20.32,21.59 90 top
R30  17.78,21.59 90 top
R31  15.24,21.59 90 top
R32  41.91,21.59 90 top
R33  39.37,21.59 90 top
R34  36.83,21.59 90 top
R35  34.29,21.59 90 top
R36  60.96,21.59 90 top
R37  58.42,21.59 90 top
R38  55.88,21.59 90 top
R39  53.34,21.59 90 top
R40  80.01,21.59 90 top
R41  77.47,21.59 90 top
R42  74.93,21.59 90 top
R43  72.39,21.59 90 top
R44  99.06,21.59 90 top
R45  96.52,21.59 90 top
R46  93.98,21.59 90 top
R47  91.44,21.59 90 top
R60  69.85,16.51 270 bottom
R61  83.82,16.51 270 bottom
S1  12.7,54.61 270 top
SJ1  26.67,53.34 180 top
SJ2  33.02,53.34 180 top
SJ3  39.37,53.34 180 top
SJ4  45.72,53.34 180 top
SJ5  20.32,53.34 180 top
UART  5.08,44.45 270 top

### Tracks (layer width: path | path; a pad name or v marks a point on that pad's centre or on a via)
+5V  (via drill 0.6)
  Top 0.203: IC1.100 61.6,53.56 61.06,54.1 60.25,54.1 v60.05,54.3 | IC1.77 73.1,56.29 v72.64,56.74 | IC1.59 82.74,46.93 83.21,47.4 v84.23,47.4
  Top 0.508: v35.46,38.86 35.02,39.3 IC2.18 35.02,44.99 32.21,47.8 | IC2.4 32.62,33.99 32.82,34.19 34.85,34.19 v35.26,34.6 34.22,33.56 IC2.6 34.22,31.57 34.65,31.14 34.65,29.92 33.02,28.3 10.46,28.3 7.01,24.84 3.96,24.84 v3.76,24.64
  Top 0.61: 32.21,47.8 32.21,49.39 R3.2 | R3.2 31.09,49.53 29.36,47.8 26.11,47.8 25.91,48.01 25.91,49.34 R2.2 24.4,48.21 13.51,48.21 | R3.2 32.07,47.94 32.21,47.8 | 32.21,47.8 36.69,47.8 R4.2 38.42,48.3 38.91,47.8 43.04,47.8 R5.2 45.01,49.29 45.01,48.62 45.82,47.8 47.65,47.8 49.28,49.43 49.28,50.85 | 49.28,50.85 49.28,51.26 55.37,57.35 57,57.35 v60.05,54.3 62.08,56.34 62.08,61.42 62.89,62.23 63.7,62.23 65.94,60 68.58,60 71.83,56.74 v72.64,56.74 77.11,56.74 84.23,49.63 v84.23,47.4 | C32.1 28.35,58.51 28.35,60 28.55,60.2 45.82,60.2 49.28,56.74 49.28,50.85 | UART.1 I2C.1 12.75,48.21 13.51,48.21 | 13.51,48.21 14.93,48.21 16.36,46.79 16.36,41.5 17.22,40.64 ISP.2 | R14.2 25.08,57.74 25.09,57.76
  Bottom 0.508: 34.94,34.6 C47.1 C20.1 34.73,38.86 v35.46,38.86 | ETH5.12 95.68,2.97 94.18,1.47 88.95,1.47 ETH5.9 84.07,1.45 ETH4.12 76.99,2.97 75.49,1.47 69.9,1.47 ETH4.9 65.02,1.45 ETH3.12 57.07,2.97 55.57,1.47 50.85,1.47 ETH3.9 45.97,1.45 ETH2.12 37.97,2.97 36.47,1.47 31.8,1.47 ETH2.9 26.92,1.45 ETH1.12 19.48,2.97 17.98,1.47 12.75,1.47 ETH1.9 7.44,1.45 LED3.A LED2.A LED1.A 3.76,15.29 v3.76,24.64
  Bottom 0.61: v72.64,56.74 72.64,58.35 C1.1 | v35.26,34.6 34.94,34.6 | 59.86,55.73 C5.1 60.05,55.84 v60.05,54.3 | v84.23,47.4 85,47.4 C4.1
  pour Top: 20.42,59.99 24.08,59.99 26.52,62.43 26.52,64.26 27.33,65.07 28.55,65.07 28.96,64.67 28.96,57.56 28.75,57.35 20.62,57.35 20.42,57.56
+5V/1  (via drill 0.6)
  Top 0.203: IC1.9 64.6,37.12 v64.72,37.24 | IC1.18 69.1,35.93 69.8,36.63 v69.8,37.24 | IC1.24 72.1,36.9 v72.44,37.24 | IC1.37 78.6,36.56 77.93,37.24 v77.52,37.24
  Top 0.61: v64.72,37.24 64.72,38.05 65.13,38.46 69.39,38.46 69.8,38.05 v69.8,37.24 69.8,37.85 70.41,38.46 72.03,38.46 72.44,38.05 v72.44,37.24 72.44,37.85 73.05,38.46 76.3,38.46 v77.52,37.24 | C34.1 5.4,53.3 2.34,50.24 2.34,38.05 10.46,29.92 v27.33,29.92 | v27.33,21.39 30.58,18.14 36.88,18.14 37.36,17.65 37.36,15.34 ETH2.4 37.46,13.97 ETH2.5 | v75.29,32.77 75.29,29.72 v77.52,27.48 | ETH1.5 18.41,13.97 ETH1.4 | ETH3.4 56.52,13.97 ETH3.5 | ETH4.4 75.57,13.97 ETH4.5 | ETH5.4 94.62,13.97 ETH5.5
  Bottom 0.61: v64.72,37.24 64.72,38.37 C8.1 | v69.8,37.24 69.8,38.37 C7.1 | C9.1 72.44,38.37 v72.44,37.24 | C6.1 77.52,38.37 v77.52,37.24 77.52,35 v75.29,32.77 | v27.33,21.39 v27.33,29.92 | v77.52,27.48 77.52,27.08 75.69,25.25 75.69,15.37 ETH4.4 | ETH1.5 19.68,12.6 20.85,11.43 37.46,11.43 ETH2.5 38.73,12.62 39.93,11.43 56.52,11.43 ETH3.5 59.05,11.43 75.57,11.43 ETH4.5 78.11,11.43 94.62,11.43 ETH5.5
  pour Top: 12.9,60.4 14.94,60.4 15.14,60.2 15.14,58.57 14.94,58.37 9.65,58.37 5.99,54.71 5.99,52.27 5.79,52.07 4.37,52.07 4.17,52.27 4.17,55.52 6.6,57.96 6.6,60.4 7.01,60.81 8.43,60.81 8.84,60.4
+5V/2  (via drill 0.6)
  Top 0.203: IC1.117 60.36,42.43 62.28,44.35 v62.28,46.79 | v77.72,43.13 78.42,42.43 IC1.50 82.92,42.43 | IC1.89 67.1,53.35 v66.34,54.1
  Top 0.61: v66.34,54.1 66.34,55.73 68.38,57.76 v68.38,58.57 | v56.19,55.93 56.19,52.68 57.81,51.05 59.03,51.05 61.67,48.41 61.67,47.4 v62.28,46.79 | v88.09,56.34 88.09,55.39 C36.1 87.31,54.14 86.46,53.29 86.46,43.74 85.24,42.52 83.01,42.52 82.92,42.43
  Bottom 0.61: v66.34,54.1 66.34,55.87 C10.1 | v62.28,46.79 63.62,46.79 C11.1 | v77.72,43.13 75.93,43.13 C12.1 | v56.19,55.93 58.01,57.76 61.47,57.76 62.08,58.37 62.08,61.42 62.89,62.23 63.7,62.23 67.36,58.57 v68.38,58.57 68.38,61.01 69.8,62.43 74.68,62.43 80.98,56.13 87.88,56.13 v88.09,56.34
  pour Top: 80.16,63.86 80.16,62.03 80.37,61.82 86.06,61.82 86.66,61.21 86.66,53.49 86.87,53.29 88.9,53.29 89.1,53.49 89.1,63.45 88.7,63.86
+5V/3  (via drill 0.6)
  Top 0.203: IC1.3 61.6,36.76 v62.28,37.44 61.29,38.43 IC1.125 57.23,38.43 57.2,38.46 55.98,38.46 v55.57,38.05 | IC1.15 67.6,37.2 v67.36,37.44 | IC1.31 75.6,36.52 v74.88,37.24
  Top 0.254: IC1.41 84.14,37.93 v84.84,37.24 | IC1.43 83.48,38.93 v85.04,40.49
  Top 0.61: v62.28,37.44 67.16,42.32 v71.02,42.32 74.07,42.32 80.57,35.81 83.41,35.81 v84.84,37.24 84.84,40.28 v85.04,40.49 96.42,51.87 96.42,54.39 C37.1
  Bottom 0.61: C17.1 62.28,38.37 v62.28,37.44 62.28,35.81 62.69,35.41 66.95,35.41 67.36,35.81 | C13.1 67.36,38.37 v67.36,37.44 67.36,35.81 | C18.1 74.88,38.37 v74.88,37.24 74.88,35.81 74.47,35.41 67.77,35.41 67.36,35.81 | v55.57,38.05 55.57,37.48 C16.1 | v84.84,37.24 86.27,37.24 C15.1 | v85.04,40.49 86.53,40.49 C14.1 | L1.2 69.01,45.95 71.02,43.94 v71.02,42.32
  pour Top: 90.32,63.86 97.43,63.86 98.04,63.25 98.04,53.7 97.84,53.49 95.81,53.49 95.61,53.7 95.61,61.21 95,61.82 90.53,61.82 90.32,62.03
+5V/4  (via drill 0.6)
  Top 0.203: IC1.123 60.61,39.43 61.67,40.49 61.67,42.52 v62.08,42.93
  Bottom 0.203: v62.08,42.93 63.57,42.93 C19.1
  Bottom 0.406: C19.1 63.72,44.57 64.11,44.96 66.57,44.96 L1.1
AGND  (via drill 0.6)
  other vias: 9.04,18.14
  pour Bottom (isolate 0.305): 9.25,20.98 11.07,20.98 11.28,20.78 11.28,19.56 11.68,19.15 105,19.15 105.21,18.95 105.21,6.55 105,6.35 8.84,6.35 8.43,6.76 8.43,18.34 9.04,18.95 9.04,20.78
  pour Top (isolate 0.305): 9.25,20.98 11.07,20.98 11.28,20.78 11.28,19.56 11.68,19.15 105,19.15 105.21,18.95 105.21,6.55 105,6.35 8.84,6.35 8.43,6.76 8.43,18.34 9.04,18.95 9.04,20.78
CS  (via drill 0.6)
  Top 0.203: IC1.112 59.67,44.93 v60.05,44.55 | IC2.14 41.78,38.03 44.6,35.2 53.54,35.2 v55.98,32.77
  Bottom 0.203: v60.05,44.55 60.05,33.99 59.84,33.78 57,33.78 v55.98,32.77
GND  (via drill 0.6)
  Top 0.203: IC1.99 62.1,53.52 v62.48,53.9 | IC1.88 67.6,53.53 v67.97,53.9 | IC1.76 73.6,53.35 73.95,53.7 v74.68,53.7
  Top 0.254: IC1.2 61.1,33.41 60.66,32.97 v59.64,32.97 | IC1.6 63.1,36.43 v63.3,36.63 | IC1.12 66.1,36.59 | IC1.16 68.1,36.15 v68.58,36.63 | IC1.21 70.6,36.01 v71.02,36.42 | IC1.27 73.6,36.36 v73.66,36.42 74.07,36.02 74.88,36.02 75.1,35.8 IC1.30 | IC1.34 77.1,35.83 v76.51,36.42 | IC1.40 80.17,37.43 79.55,38.05 v79.55,38.46 79.58,38.43 IC1.42 | IC1.44 79.59,39.43 v79.15,39.88 | IC1.49 79.17,41.93 v78.74,41.5 | IC1.58 83.36,46.43 v83.41,46.38 | IC1.127 57.01,37.43 v56.79,37.64 57.08,37.93 IC1.126 | IC1.124 57.34,38.93 57,39.27 54.76,39.27 v54.15,38.66 | IC1.116 v56.19,42.93
  Top 0.508: 31.82,30.96 IC2.3 | v33.42,30.94 IC2.5 | IC2.21 32.62,42.32
  Top 0.61: R25.1 43.45,78.42 v43.38,78.49 | C22.2 64.77,78.54 v64.92,78.69 | C27.2 30.48,68.43 v30.58,68.33 | C33.2 11.43,65.13 v11.48,65.08 | C34.2 8.33,53.34 v9.65,52.02 9.6,52.07 S1.4 S1.3 | SJ1.3 25.09,53.29 25.09,52.83 v24.13,51.87 | SJ2.3 31.5,54.2 v30.79,54.92 | SJ3.3 37.85,54.36 v36.88,55.32 | SJ4.3 44.2,54.51 v43.18,55.52 | R27.1 60.13,60.11 v60.25,60 | C35.2 72.93,62.55 v74.27,61.21 | C36.2 82.91,54.61 v82.6,54.92 | C37.2 91.85,54.61 v91.34,55.12 | 66.1,36.59 v66.14,36.63 | L6.2 10.16,25.96 v10.26,26.06 | C38.2 12.7,25.65 v12.29,26.06 | C39.2 46.98,22.54 v47.45,23.01 47.92,22.54 C42.2 | C29.2 28.08,22.54 v28.55,23.01 29.02,22.54 C40.2 | C41.2 66.28,22.54 v66.75,23.01 | v66.75,23.01 67.22,22.54 C44.2 | C46.2 86.12,22.54 v85.65,23.01 85.18,22.54 C43.2 | C45.2 101.7,22.64 v101.7,25.65 | R23.1 2.54,25.45 v2.13,25.86 | v31.8,30.94 31.82,30.96 | v33.43,30.94 v33.42,30.94 | 32.62,42.32 v32.82,42.52 | C32.2 30.21,58.37 v31.6,58.37 | v66.75,23.01 66.75,24.03 71.43,28.7 v71.43,31.14 | C48.2 21.08,55.88 v21.64,55.32
  Bottom 0.61: v28.55,23.01 28.55,25.45 | v47.45,23.01 47.45,25.65 | v85.65,23.01 85.65,25.65
  other vias: 83.62,27.69 87.07,30.33 79.15,32.77 71.63,47.8 72.44,45.97 74.47,45.57
  pour Bottom (isolate 0.305): 0,82.55 105.41,82.55 105.41,25.4 0,25.4
  pour Top (isolate 0.305): 0,50.8 105.41,50.8 105.41,25.4 0,25.4
  pour Top (isolate 0.305): 105.41,50.8 105.41,82.55 78.74,82.55 78.74,77.47 90.17,77.47 100.33,67.31 100.33,50.8
LED1-0  (via drill 0.6)
  Top 0.203: IC1.106 52.6,47.93 v50.7,49.84
  Bottom 0.203: R12.1 26.67,18.69 29.36,21.39 29.36,22.4 29.97,23.01 29.97,23.42 34.65,28.09 37.08,28.09 47.65,38.66 47.65,46.79 v50.7,49.84
LED1-2  (via drill 0.6)
  Top 0.203: IC1.104 55.06,48.93 v53.75,50.24
  Bottom 0.203: R13.1 30.48,22.3 34.24,26.06 36.88,26.06 49.07,38.25 49.07,45.57 v53.75,50.24
LED2-0  (via drill 0.6)
  Top 0.203: IC1.103 56.59,49.43 55.37,50.65 v55.37,51.26
  Bottom 0.203: R10.1 45.72,18.03 49.48,21.79 49.48,36.83 50.09,37.44 50.09,41.71 51.31,42.93 53.14,42.93 55.37,45.16 v55.37,51.26
LED2-2  (via drill 0.6)
  Top 0.203: IC1.101 61.1,53.05 60.86,53.29 58.42,53.29 v58.01,52.88
  Bottom 0.203: R11.1 49.53,18.19 50.9,19.56 50.9,37.03 54.15,40.28 54.15,42.52 56.39,44.76 56.39,51.26 v58.01,52.88
LED3-0  (via drill 0.6)
  Top 0.203: IC1.98 62.6,48.5 63.5,47.6 68.38,47.6 v68.58,47.8
  Bottom 0.203: v68.58,47.8 68.58,49.23 68.78,49.43 74.27,49.43 80.57,43.13 80.57,32.36 78.33,30.12 70.21,30.12 64.97,24.89 64.97,17.66 R6.1
LED3-2  (via drill 0.6)
  Top 0.203: IC1.96 63.6,48.92 64.31,48.21 66.95,48.21 v67.56,48.82
  Bottom 0.203: v67.56,48.82 67.56,50.04 74.47,50.04 81.18,43.33 81.18,31.95 78.54,29.31 71.22,29.31 67.56,25.65 67.56,18.03 67.41,17.88 67.41,17.56 R7.1
LED4-0  (via drill 0.6)
  Top 0.203: IC1.95 64.11,53.29 63.7,53.7 63.7,56.34 63.09,56.95 v63.09,60.81
  Bottom 0.203: v63.09,60.81 63.09,59.18 63.7,58.57 63.7,51.87 64.92,50.65 74.68,50.65 81.79,43.54 81.79,31.34 78.94,28.5 71.22,28.5 69.85,27.13 R60.1
LED4-2  (via drill 0.6)
  Top 0.203: IC1.93 65.1,52.91 64.52,53.49 64.52,56.74 64.11,57.15 v64.11,59.79
  Bottom 0.203: v64.11,59.79 64.31,59.59 64.31,52.27 65.33,51.26 74.88,51.26 82.4,43.74 82.4,18.88 R61.1
LED5-0  (via drill 0.6)
  Top 0.203: IC1.92 65.6,53.02 65.13,53.49 v65.13,58.78
  Bottom 0.203: v65.13,58.78 64.72,58.37 64.72,52.68 65.53,51.87 75.08,51.87 83.01,43.94 83.01,29.92 86.87,26.06 86.87,17.97 R8.1
LED5-2  (via drill 0.6)
  Top 0.203: IC1.90 66.6,52.83 66.34,53.09 66.14,53.09 65.53,53.7 65.53,57.15 v66.14,57.76
  Bottom 0.203: v66.14,57.76 65.73,57.76 65.13,57.15 65.13,53.29 65.94,52.48 75.29,52.48 83.62,44.15 83.62,31.75 88.9,26.47 R9.1
MISO  (via drill 0.6)
  Top 0.203: IC1.109 59.28,46.43 59.64,46.79 59.64,46.99 v60.45,47.8 | v57.4,34.8 55.78,36.42 45.41,36.42 42.21,39.63 IC2.16 37.65,39.63 v38.51,40.49 | v27.33,40.28 21.95,40.28 ISP.1
  Bottom 0.203: v60.45,47.8 59.64,47.8 57.81,45.97 57.81,43.33 58.42,42.72 58.42,37.85 57.4,36.83 v57.4,34.8 | v38.51,40.49 27.53,40.49 v27.33,40.28
MODE  (via drill 0.6)
  Top 0.203: IC2.9 37.31,33.96 v39.32,31.95 | v15.7,57.15 S1.1 S1.2
  Bottom 0.203: v39.32,31.95 39.73,31.95 40.54,32.77 40.54,48.41 32.61,56.34 16.51,56.34 v15.7,57.15
MOSI  (via drill 0.6)
  Top 0.203: IC1.111 61.2,45.43 v61.27,45.36 | v57.61,32.77 54.56,35.81 45.01,35.81 41.99,38.83 IC2.15 36.65,38.83 35.66,37.85 32,37.85 27.94,41.91 20.32,41.91 ISP.4
  Bottom 0.203: v61.27,45.36 61.27,44.15 60.66,43.54 60.66,32.36 60.25,31.95 58.42,31.95 v57.61,32.77
N$1  (via drill 0.6)
  Top 0.203: IC1.17 68.6,33.4 v67.77,32.56
  Bottom 0.203: v67.77,32.56 67.77,30.97 R1.2
N$2
  Top 0.203: IC1.122 52.78,39.93 Q1.1 C2.1
N$3
  Top 0.203: SJ1.1 28.19,50.1 R2.1
N$4
  Top 0.203: IC1.121 55.02,40.43 52.12,43.33 52.12,45.67 Q1.2 50.9,44.55 50.8,44.45 C3.1
N$5  (via drill 0.6)
  Top 0.203: v30.38,14.28 30.18,14.07 28.14,14.07 22.66,8.59 22.66,1.65 ETH1.11
  Bottom 0.203: R13.2 30.48,14.38 v30.38,14.28
N$6
  Top 0.203: SJ2.1 34.54,50.1 R3.1
N$7
  Top 0.203: SJ4.1 47.24,50.1 R5.1
N$8
  Top 0.203: SJ3.1 40.89,50.1 R4.1
N$9  (via drill 0.6)
  Top 0.203: ETH3.10 64.57,14.17 v64.57,14.28
  Bottom 0.203: R6.2 64.77,14.48 v64.57,14.28
N$10  (via drill 0.6)
  Top 0.203: v67.01,14.28 66.75,14.28 66.6,14.12 60.05,7.57 60.05,2.36 ETH3.11
  Bottom 0.203: R7.2 67.31,14.58 v67.01,14.28
N$11  (via drill 0.6)
  Top 0.203: v86.46,14.28 86.46,13.06 91.95,7.57 91.95,3.45 ETH5.10
  Bottom 0.203: R8.2 86.36,14.38 v86.46,14.28
N$12  (via drill 0.6)
  Top 0.203: v89.1,14.28 89.1,11.63 98.65,2.08 98.65,1.85 ETH5.11
  Bottom 0.203: R9.2 88.9,14.48 v89.1,14.28
N$13  (via drill 0.6)
  Top 0.203: ETH2.10 v45.62,14.28
  Bottom 0.203: R10.2 45.72,14.38 v45.62,14.28
N$14  (via drill 0.6)
  Top 0.203: v26.52,14.28 26.52,14.22 ETH1.10
  Bottom 0.203: R12.2 26.67,14.43 v26.52,14.28
N$15  (via drill 0.6)
  Top 0.203: v49.28,14.28 47.65,14.28 41.55,8.18 41.55,1.8 ETH2.11
  Bottom 0.203: R11.2 49.53,14.53 v49.28,14.28
N$23
  Top 0.203: R21.2 7.62,16.51 LED1.K
N$24
  Top 0.203: R22.2 5.08,16.21 2.54,13.66 2.54,8.89 LED2.K
N$25
  Top 0.203: R23.2 2.54,15.09 1.73,14.28 1.73,4.62 LED3.K
N$26
  Top 0.203: IC2.27 16.78,38.03 15.75,39.07 15.75,44.35 14.53,45.57 12.85,45.57 I2C.2
N$27
  pour Top: 88.09,73.61 90.93,73.61 92.15,72.39 92.15,69.95 90.93,68.73 56.18,68.73 55.17,67.72 55.17,66.29 54.15,65.28 50.09,65.28 49.68,65.68 49.68,72.59 50.29,73.2 61.87,73.2 63.09,74.42 79.35,74.42 82.19,71.58 86.06,71.58
N$28
  pour Top: 50.09,62.84 50.09,64.06 50.7,64.67 54.76,64.67 56.18,66.09 56.18,67.11 56.79,67.72 91.95,67.72 92.96,66.7 92.96,65.28 92.35,64.67 75.9,64.67 74.68,63.45 62.89,63.45 61.26,65.07 57.2,65.07 54.36,62.23 50.7,62.23
N$29
  Top 0.203: IC2.28 27.34,37.23 27.13,37.44 16.15,37.44 15.14,38.46 15.14,42.52 14.53,43.13 12.75,43.13 I2C.3
N$30
  Top 0.406: UART.2 6.45,45.72 9.04,43.13 9.04,37.64 11.05,35.63 IC2.30
N$31
  Top 0.406: IC2.31 10.84,34.83 8.23,37.44 8.23,41.91 7.01,43.13 5.13,43.13 UART.3
N$47
  Top 0.813: IC3.1 48.87,77.47 47.85,76.45 45.79,76.45 R25.2 R24.1
N$48
  Top 0.813: IC4.1 54.71,60.96 55.78,62.03 58.41,62.03 R27.2 R26.1
N$49
  pour Top: 50.5,76.05 53.34,76.05 53.75,75.44 53.75,74.42 53.34,73.81 49.89,73.81 47.65,71.58 47.65,70.56 46.63,69.55 39.32,69.55 37.69,71.17 27.33,71.17 24.08,67.92 24.08,62.64 22.86,61.42 20.02,61.42 19,62.43 19,70.76 23.67,75.44 39.32,75.44 42.37,72.39 46.84,72.39
N$50
  pour Top: 14.33,74.83 16.15,74.83 16.76,74.22 16.76,62.43 15.75,61.42 12.9,61.42 12.09,62.23 12.09,63.25 13.31,64.47 13.31,68.53 12.9,68.94 10.26,68.94 10.06,68.73 5.79,68.73 5.18,69.34 5.18,70.56 5.79,71.17 10.67,71.17
N$51
  Top 0.406: R29.1 R28.1 C29.1
N$53
  Top 0.406: C38.1 R31.1 R30.1
N$54
  Top 0.406: R33.1 R32.1 C39.1
N$55
  Top 0.406: C40.1 R35.1 R34.1
N$56
  Top 0.406: R37.1 R36.1 C41.1
N$57
  Top 0.406: C42.1 R39.1 R38.1
N$58
  Top 0.406: R41.1 R40.1 C43.1
N$59
  Top 0.406: C44.1 R43.1 R42.1
N$60
  Top 0.406: R45.1 R44.1 C45.1
N$61
  Top 0.406: C46.1 R47.1 R46.1
N$68  (via drill 0.6)
  Top 0.203: v69.65,14.28 69.65,11.79 73.86,7.57 73.86,4.42 ETH4.10
  Bottom 0.203: R60.2 69.85,14.48 v69.65,14.28
N$69  (via drill 0.6)
  Top 0.203: v83.62,14.28 83.62,13.46 78.94,8.79 78.94,2.52 ETH4.11
  Bottom 0.203: R61.2 83.82,14.48 v83.62,14.28
PS0  (via drill 0.6)
  Top 0.203: IC1.114 57.01,43.93 53.95,46.99 48.67,46.99 48.26,46.58 37.08,46.58 v36.68,46.18 | v26.72,51.46 26.67,51.51 SJ1.2
  Bottom 0.203: v36.68,46.18 36.07,45.57 30.38,45.57 26.72,49.23 v26.72,51.46
PS1  (via drill 0.6)
  Top 0.203: IC1.113 57.12,44.43 54.15,47.4 48.26,47.4 48.06,47.19 36.07,47.19 v35.46,46.58 | v33.02,51.46 SJ2.2
  Bottom 0.203: v35.46,46.58 33.02,49.02 v33.02,51.46
RST
  Top 0.203: C48.1 20.32,53.66 SJ5.2 20.62,53.65 20.62,54.3 20.83,54.51 22.25,54.51 23.18,55.44 R14.1
RXM1  (via drill 0.6)
  Top 0.203: IC1.5 62.6,33.29 60.25,30.94 44.4,30.94 39.93,26.47 18.19,26.47 17.78,26.06 v17.78,23.82 R30.2
  Bottom 0.203: v17.78,23.82 15.95,22 15.95,15.32 ETH1.2
RXM2  (via drill 0.6)
  Top 0.203: IC1.11 65.6,33.04 61.47,28.91 45.41,28.91 40.95,24.43 37.08,24.43 36.83,24.18 R34.2 36.83,23.77 v36.88,23.82
  Bottom 0.203: v36.88,23.82 35.05,22 35.05,15.37 ETH2.2
RXM3  (via drill 0.6)
  Top 0.203: 55.88,24.13 54.97,25.04 54.97,25.65 56.39,27.08 64.11,27.08 70.1,33.07 IC1.20 | 55.88,24.13 55.88,23.93 v55.78,24.03 | 55.88,24.13 R38.2
  Bottom 0.203: v55.78,24.03 53.95,22.2 53.95,15.26 ETH3.2
RXM4  (via drill 0.6)
  Top 0.203: IC1.26 73.1,25.4 v74.27,24.23 | v74.27,24.23 74.88,23.62 74.88,22.59 R42.2 74.93,23.57 v74.27,24.23
  Bottom 0.203: v74.27,24.23 73.25,23.22 73.25,15.47 ETH4.2
RXM5  (via drill 0.6)
  Top 0.203: IC1.33 76.6,30.44 81.79,25.25 92.56,25.25 v93.57,24.23 93.98,23.82 R46.2
  Bottom 0.203: v93.57,24.23 91.95,22.61 91.95,15.37 ETH5.2
RXP1  (via drill 0.6)
  Top 0.203: IC1.4 62.08,34.56 62.08,33.38 60.05,31.34 44.2,31.34 39.73,26.87 17.58,26.87 15.24,24.54 R31.2 15.24,23.72 v15.34,23.82
  Bottom 0.203: v15.34,23.82 15.34,16.92 14.53,16.1 14.53,12.78 ETH1.1
RXP2  (via drill 0.6)
  Top 0.203: IC1.10 65.1,33.2 65.13,33.17 61.27,29.31 45.21,29.31 40.74,24.84 34.85,24.84 34.29,24.28 R35.2 34.29,23.67 v34.44,23.82
  Bottom 0.203: v34.44,23.82 34.44,16.92 33.63,16.1 33.63,12.72 ETH2.1
RXP3  (via drill 0.6)
  Top 0.203: IC1.19 69.6,33.17 63.91,27.48 56.19,27.48 53.34,24.64 v53.34,24.03 R39.2
  Bottom 0.203: v53.34,24.03 53.34,16.92 52.73,16.31 52.73,12.72 ETH3.1
RXP4  (via drill 0.6)
  Top 0.203: IC1.25 72.6,22.75 R43.2 72.39,22.55 72.64,22.81 v72.64,24.23
  Bottom 0.203: v72.64,24.23 72.64,16.92 71.83,16.1 71.83,12.78 ETH4.1
RXP5  (via drill 0.6)
  Top 0.203: IC1.32 76.1,30.33 81.59,24.84 90.73,24.84 v91.34,24.23 91.34,22.81 | 91.34,22.81 91.34,22.64 R47.2 91.44,22.71 91.34,22.81
  Bottom 0.203: v91.34,24.23 91.34,16.92 90.73,16.31 90.73,12.78 ETH5.1
SCK  (via drill 0.6)
  Top 0.203: IC1.110 60,45.93 v60.45,46.38 | v59.23,34.6 57.81,36.02 57,36.02 55.98,37.03 45.82,37.03 41.76,41.1 39.52,41.1 38.91,41.71 38.1,41.71 37.52,41.12 IC2.17 35.82,41.66 v36.88,42.72 | v30.58,43.33 21.74,43.33 ISP.3
  Bottom 0.203: v60.45,46.38 59.64,46.38 58.83,45.57 58.83,43.94 59.23,43.54 v59.23,34.6 | v36.88,42.72 36.07,43.54 30.79,43.54 v30.58,43.33
SCONF0  (via drill 0.6)
  Top 0.203: IC1.87 68.1,50.37 67.97,50.24 65.73,50.24 v64.72,49.23 | v39.32,55.12 39.32,53.39 SJ3.2
  Bottom 0.203: v64.72,49.23 63.09,49.23 58.42,53.9 40.54,53.9 v39.32,55.12
SCONF1  (via drill 0.6)
  Top 0.203: IC1.86 68.6,49.86 68.38,49.63 66.55,49.63 v66.14,49.23 | v45.82,55.12 45.82,53.44 SJ4.2
  Bottom 0.203: v66.14,49.23 65.33,50.04 63.09,50.04 58.62,54.51 46.43,54.51 v45.82,55.12
STATUS0  (via drill 0.6)
  Top 0.203: IC2.10 38.27,34.83 v39.52,33.58 | R21.1 v7.62,23.82
  Bottom 0.203: v39.52,33.58 39.32,33.58 38.3,32.56 15.34,32.56 7.82,25.04 7.82,24.03 v7.62,23.82
STATUS1  (via drill 0.6)
  Top 0.203: IC2.11 38.89,35.63 v39.12,35.41 | v5.18,23.62 5.18,22.64 R22.1
  Bottom 0.203: v39.12,35.41 39.12,34.8 37.49,33.17 14.73,33.17 v5.18,23.62
SW-RESET  (via drill 0.6)
  Top 0.203: IC1.115 56.9,43.43 53.75,46.58 49.28,46.58 48.67,45.97 38.3,45.97 v36.88,44.55 | v21.23,51.46 21.84,52.07 SJ5.1
  Bottom 0.203: v36.88,44.55 27.13,44.55 21.23,50.44 v21.23,51.46
TXM1  (via drill 0.6)
  Top 0.203: IC1.8 64.1,33.18 64.11,33.17 60.86,29.92 44.81,29.92 40.34,25.45 23.06,25.45 22.86,25.25 v22.86,23.82 R28.2
  Bottom 0.203: v22.86,23.82 21.03,22 21.03,15.32 ETH1.6
TXM2  (via drill 0.6)
  Top 0.203: IC1.14 67.1,33.12 62.08,28.09 45.82,28.09 41.91,24.18 R32.2 41.91,23.57 v41.96,23.62
  Bottom 0.203: v41.96,23.62 40.01,21.67 ETH2.6
TXM3  (via drill 0.6)
  Top 0.203: IC1.23 71.63,34.55 71.63,32.77 64.72,25.86 61.47,25.86 60.96,25.35 R36.2 60.96,23.93 v61.06,24.03
  Bottom 0.203: v61.06,24.03 59.05,22.02 ETH3.6
TXM4  (via drill 0.6)
  Top 0.203: IC1.29 74.6,33.3 74.47,33.17 74.47,29.11 v79.35,24.23 | v79.35,24.23 79.96,23.62 79.96,22.59 R40.2 80.01,23.57 v79.35,24.23
  Bottom 0.203: v79.35,24.23 78.11,22.99 ETH4.6
TXM5  (via drill 0.6)
  Top 0.203: IC1.36 78.1,30.56 81.99,26.67 95.4,26.67 v97.84,24.23 99.06,23.01 R44.2
  Bottom 0.203: v97.84,24.23 97.16,23.55 ETH5.6
TXP1  (via drill 0.6)
  Top 0.203: 20.36,22.54 R29.2 20.32,25.15 21.03,25.86 40.13,25.86 44.6,30.33 60.66,30.33 63.6,33.27 IC1.7 | 20.36,22.54 20.42,22.61 | 20.36,22.54 20.36,23.76 v20.42,23.82
  Bottom 0.203: v20.42,23.82 19.81,23.22 19.81,14.88 17.78,12.85 17.3,12.85 ETH1.3
TXP2  (via drill 0.6)
  Top 0.203: IC1.13 66.6,33.22 61.87,28.5 45.62,28.5 41.15,24.03 39.93,24.03 39.37,23.47 R33.2 39.37,23.57 v39.32,23.62
  Bottom 0.203: v39.32,23.62 38.71,23.01 38.71,14.48 36.93,12.7 ETH2.3
TXP3  (via drill 0.6)
  Top 0.203: IC1.22 71.1,32.85 64.52,26.26 60.45,26.26 58.42,24.23 R37.2 v58.42,24.03
  Bottom 0.203: v58.42,24.03 57.81,23.42 57.81,14.68 55.83,12.7 ETH3.3
TXP4  (via drill 0.6)
  Top 0.203: IC1.28 74.1,33.41 74.07,33.38 74.07,28.91 77.52,25.45 v77.52,24.23 | v77.52,24.23 77.52,22.59 R41.2 77.47,24.18 v77.52,24.23
  Bottom 0.203: v77.52,24.23 76.71,23.42 76.71,14.28 75.13,12.7 ETH4.3
TXP5  (via drill 0.6)
  Top 0.203: IC1.35 77.6,30.45 81.79,26.26 95.2,26.26 96.42,25.04 v96.42,24.23 96.42,23.01 | 96.42,23.01 96.42,22.64 R45.2 96.52,22.91 96.42,23.01
  Bottom 0.203: v96.42,24.23 95.81,23.62 95.81,14.28 94.23,12.7 ETH5.3
UC-RESET  (via drill 0.6)
  Top 0.203: IC2.29 26.51,36.43 v26.31,36.63 | v19.61,51.46 18.8,52.27 SJ5.3
  Bottom 0.203: v26.31,36.63 26.31,41 ISP.5 21.59,47.04 19.2,49.43 19.2,51.05 v19.61,51.46

### Text on the board
_tsilk: 1V8 | 2V5 | 3V3 | PS0 | PS1 | SC0 | SC1 | RST | VCC | VCC | GND | RX | SDA | TX | SCL | GND | GND | VCC | 5p-switch - rev 0 - Balto | P5 | P4 | P3 | P2 | P1 | S1 | S0 | PWR